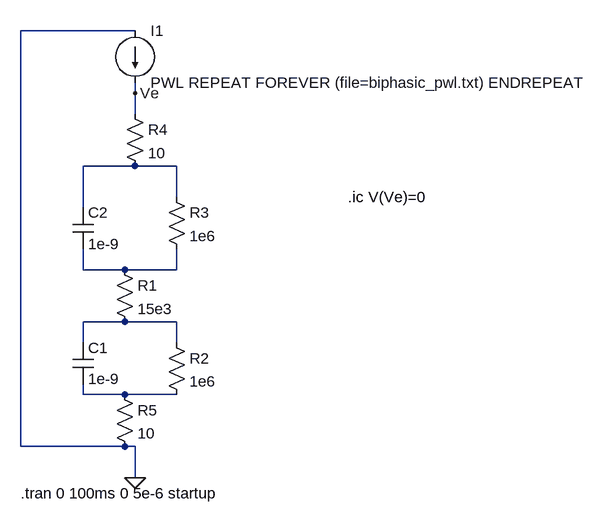
[diagram p0: schematic biphasic_triphasic.asc]
biphasic_triphasic.asc, the LTspice schematic file:
Version 4
SHEET 1 1384 680
WIRE 176 -368 0 -368
WIRE 176 -272 176 -288
WIRE 176 -240 176 -272
WIRE 176 -160 96 -160
WIRE 240 -160 176 -160
WIRE 240 -112 240 -160
WIRE 96 -96 96 -160
WIRE 96 0 96 -32
WIRE 160 0 96 0
WIRE 240 0 240 -32
WIRE 240 0 160 0
WIRE 160 80 96 80
WIRE 240 80 160 80
WIRE 96 112 96 80
WIRE 240 112 240 80
WIRE 96 192 96 176
WIRE 160 192 96 192
WIRE 240 192 160 192
WIRE 0 272 0 -368
WIRE 160 272 0 272
WIRE 176 272 160 272
WIRE 176 320 176 272
FLAG 176 320 0
FLAG 176 -272 Ve
SYMBOL cap 80 112 R0
SYMATTR InstName C1
SYMATTR Value 1e-9
SYMBOL cap 80 -96 R0
SYMATTR InstName C2
SYMATTR Value 1e-9
SYMBOL res 144 -16 R0
SYMATTR InstName R1
SYMATTR Value 15e3
SYMBOL res 224 96 R0
SYMATTR InstName R2
SYMATTR Value 1e6
SYMBOL res 224 -128 R0
SYMATTR InstName R3
SYMATTR Value 1e6
SYMBOL res 160 -256 R0
SYMATTR InstName R4
SYMATTR Value 10
SYMATTR SpiceLine tol=1 pwr=1
SYMBOL res 144 176 R0
SYMATTR InstName R5
SYMATTR Value 10
SYMBOL current 176 -368 R0
SYMATTR InstName I1
SYMATTR Value PWL REPEAT FOREVER (file=biphasic_pwl.txt) ENDREPEAT
TEXT 0 344 Left 2 !.tran 0 100ms 0 5e-6 startup
TEXT 504 -112 Left 2 !.ic V(Ve)=0

The netlist it stands for:
* biphasic_triphasic.asc
C1 N003 N004 1e-9
C2 N001 N002 1e-9
R1 N002 N003 15e3
R2 N003 N004 1e6
R3 N001 N002 1e6
R4 Ve N001 10 tol=1 pwr=1
R5 N004 0 10
I1 0 Ve PWL REPEAT FOREVER (file=biphasic_pwl.txt) ENDREPEAT
.tran 0 100ms 0 5e-6 startup
.ic V(Ve)=0
.backanno
.end